# EAGLE design MotorController (EAGLE 9.6.2)

## Sheet 1 of 3
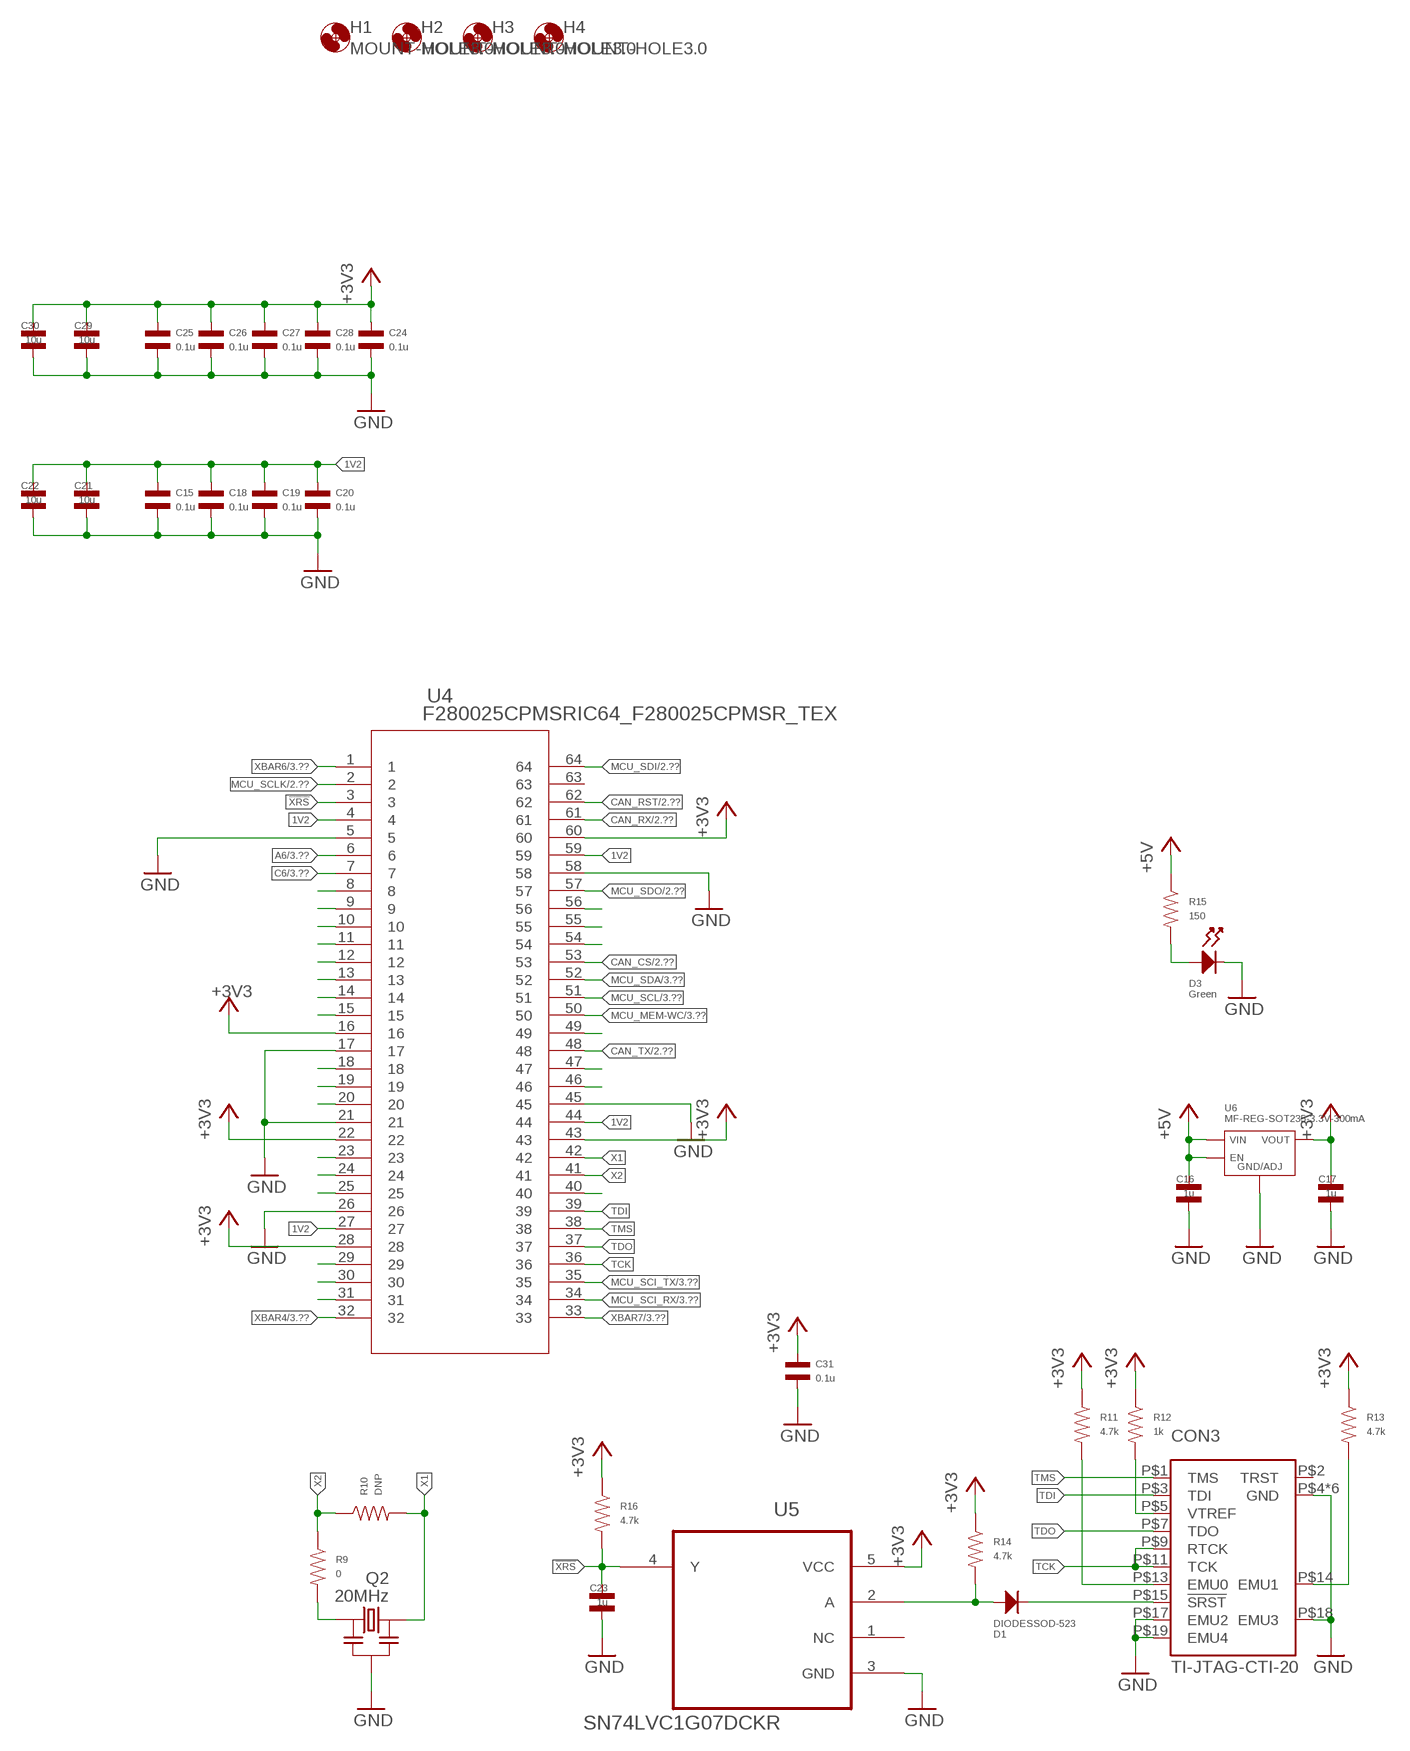
[diagram p0: schematic, sheet 1]

### Parts
C15  0.1u  CAPACITOR_NP_0402  [C0402]
C16  1u  CAPACITOR_NP_0805  [C0805]
C17  1u  CAPACITOR_NP_0805  [C0805]
C18  0.1u  CAPACITOR_NP_0402  [C0402]
C19  0.1u  CAPACITOR_NP_0402  [C0402]
C20  0.1u  CAPACITOR_NP_0402  [C0402]
C21  10u  CAPACITOR_NP_0805  [C0805]
C22  10u  CAPACITOR_NP_0805  [C0805]
C23  1u  CAPACITOR_NP_0402  [C0402]
C24  0.1u  CAPACITOR_NP_0402  [C0402]
C25  0.1u  CAPACITOR_NP_0402  [C0402]
C26  0.1u  CAPACITOR_NP_0402  [C0402]
C27  0.1u  CAPACITOR_NP_0402  [C0402]
C28  0.1u  CAPACITOR_NP_0402  [C0402]
C29  10u  CAPACITOR_NP_0805  [C0805]
C30  10u  CAPACITOR_NP_0805  [C0805]
C31  0.1u  CAPACITOR_NP_0402  [C0402]
CON3  TI-JTAG-CTI-20  [FTR-110-51-L-D-06]
D1  DIODESSOD-523  [SOD523]
D3  Green  LED_SINGLE-0603  [LED0603]
H1  MOUNT-HOLE3.0  [3,0]
H2  MOUNT-HOLE3.0  [3,0]
H3  MOUNT-HOLE3.0  [3,0]
H4  MOUNT-HOLE3.0  [3,0]
Q2  20MHz  RESONATORCSTNE  [CSTNE]
R9  0  RESISTOR_0402  [R0402]
R10  DNP  RESISTOR_0402  [R0402]
R11  4.7k  RESISTOR_0402  [R0402]
R12  1k  RESISTOR_0402  [R0402]
R13  4.7k  RESISTOR_0402  [R0402]
R14  4.7k  RESISTOR_0402  [R0402]
R15  150  RESISTOR_0805  [R0805]
R16  4.7k  RESISTOR_0402  [R0402]
U4  F280025CPMSRIC64_F280025CPMSR_TEX  [IC64_F280025CPMSR_TEX]
U5  SN74LVC1G07DCKR  [SOT65P210X110-5N]
U6  MF-REG-SOT235-3.3V-300mA  TLV70233PDBVR  [SOT-23-5]

### Nets
1V2: C15.P$1 C18.P$1 C19.P$1 C20.P$1 C21.P$1 C22.P$1 U4.4 U4.27 U4.44 U4.59
!XRS: C23.P$1 R16.P$2 U4.3 U5.4(Y)
+3V3: C17.P$1 C24.P$1 C25.P$1 C26.P$1 C27.P$1 C28.P$1 C29.P$1 C30.P$1 C31.P$1 R11.P$1 R12.P$1 R13.P$1 R14.P$1 R16.P$1 U4.16 U4.22 U4.28 U4.43 U4.60 U5.5(VCC) U6.P$5(VOUT) ; also sheet 2,3
+5V: C16.P$1 R15.P$1 U6.P$1(VIN) U6.P$3(EN) ; also sheet 2,3
A6: U4.6 ; also sheet 3
C6: U4.7 ; also sheet 3
CAN_CS: U4.53 ; also sheet 2
CAN_RST: U4.62 ; also sheet 2
CAN_RX: U4.61 ; also sheet 2
CAN_TX: U4.48 ; also sheet 2
GND: C15.P$2 C16.P$2 C17.P$2 C18.P$2 C19.P$2 C20.P$2 C21.P$2 C22.P$2 C23.P$2 C24.P$2 C25.P$2 C26.P$2 C27.P$2 C28.P$2 C29.P$2 C30.P$2 C31.P$2 CON3.P$4(GND) CON3.P$8(GND) CON3.P$10(GND) CON3.P$12(GND) CON3.P$16(GND) CON3.P$17(EMU2) CON3.P$18(EMU3) CON3.P$19(EMU4) CON3.P$20(GND) D3.CATHODE Q2.2(GND) U4.5 U4.17 U4.21 U4.26 U4.45 U4.58 U5.3(GND) U6.P$2(GND/ADJ) ; also sheet 2,3
MCU_MEM-WC: U4.50 ; also sheet 3
MCU_SCI_RX: U4.34 ; also sheet 3
MCU_SCI_TX: U4.35 ; also sheet 3
MCU_SCL: U4.51 ; also sheet 3
MCU_SCLK: U4.2 ; also sheet 2
MCU_SDA: U4.52 ; also sheet 3
MCU_SDI: U4.64 ; also sheet 2
MCU_SDO: U4.57 ; also sheet 2
N$1: D3.ANODE R15.P$2
N$2: U4.18
N$3: U4.19
N$5: CON3.P$5(VTREF) R12.P$2
N$6: Q2.3(XOUT) R9.P$2
N$7: U4.23
N$8: U4.24
N$9: U4.25
N$10: CON3.P$13(EMU0) R11.P$2
N$11: CON3.P$14(EMU1) R13.P$2
N$12: CON3.P$15(!SRST) D1.C(CATHODE)
N$13: U4.29
N$14: U4.30
N$15: U4.31
N$20: U4.49
N$22: U4.20
N$24: U4.40
N$25: D1.A(ANODE) R14.P$2 U5.2(A)
N$27: U4.9
N$29: U4.10
N$30: U4.46
N$31: U4.47
N$32: U4.11
N$33: U4.12
N$34: U4.13
N$35: U4.14
N$36: U4.15
N$40: U4.8
N$54: U4.54
N$55: U4.55
N$56: U4.56
TCK: CON3.P$9(RTCK) CON3.P$11(TCK) U4.36
TDI: CON3.P$3(TDI) U4.39
TDO: CON3.P$7(TDO) U4.37
TMS: CON3.P$1(TMS) U4.38
X1: Q2.1(XIN) R10.P$2 U4.42
X2: R9.P$1 R10.P$1 U4.41
XBAR4: U4.32 ; also sheet 3
XBAR6: U4.1 ; also sheet 3
XBAR7: U4.33 ; also sheet 3
Unconnected: CON3.P$2(TRST) U4.63 U5.1(NC)

## Sheet 2 of 3
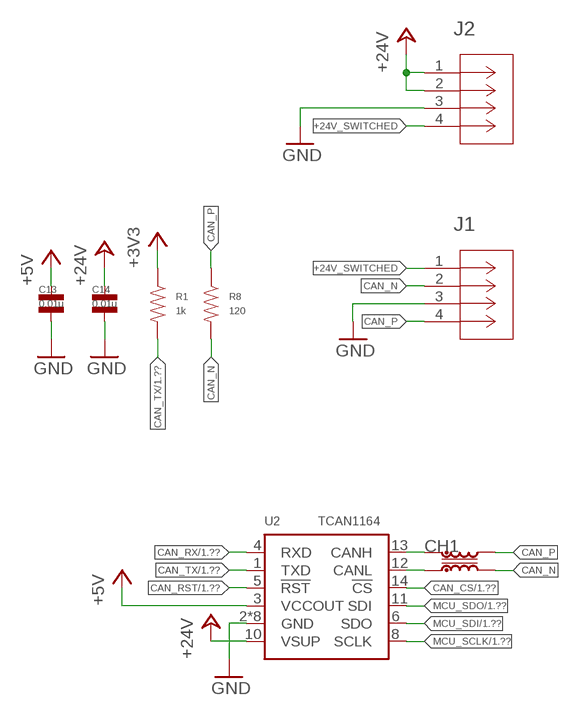
[diagram p1: schematic, sheet 2]

### Parts
C13  0.01u  CAPACITOR_NP_0402  [C0402]
C14  0.01u  CAPACITOR_NP_0402  [C0402]
CH1  CHOKE-COMMON_MODECM1210-LAIRD  [CM1210-LAIRD]
J1  768250004CON_768250004_MOL  [CON_768250004_MOL]
J2  768250004CON_768250004_MOL  [CON_768250004_MOL]
R1  1k  RESISTOR_0402  [R0402]
R8  120  RESISTOR_0402  [R0402]
U2  TCAN1164  [CONV_TPS63021DSJ]

### Nets
+3V3: R1.P$1 ; also sheet 1,3
+5V: C13.P$1 U2.3(VCCOUT) ; also sheet 1,3
+24V: C14.P$1 J2.1 J2.2 U2.10(VSUP)
+24V_SWITCHED: J1.1 J2.4
CAN_CS: U2.14(!CS) ; also sheet 1
CAN_N: CH1.P$3 J1.2 R8.P$2
CAN_P: CH1.P$2 J1.4 R8.P$1
CAN_RST: U2.5(!RST) ; also sheet 1
CAN_RX: U2.4(RXD) ; also sheet 1
CAN_TX: R1.P$2 U2.1(TXD) ; also sheet 1
GND: C13.P$2 C14.P$2 J1.3 J2.3 U2.2(GND) U2.15(GND) U2.15_1(GND) U2.15_2(GND) U2.15_3(GND) U2.15_4(GND) U2.15_5(GND) U2.15_6(GND) ; also sheet 1,3
MCU_SCLK: U2.8(SCLK) ; also sheet 1
MCU_SDI: U2.6(SDO) ; also sheet 1
MCU_SDO: U2.11(SDI) ; also sheet 1
N$4: CH1.P$4 U2.12(CANL)
N$17: CH1.P$1 U2.13(CANH)

## Sheet 3 of 3
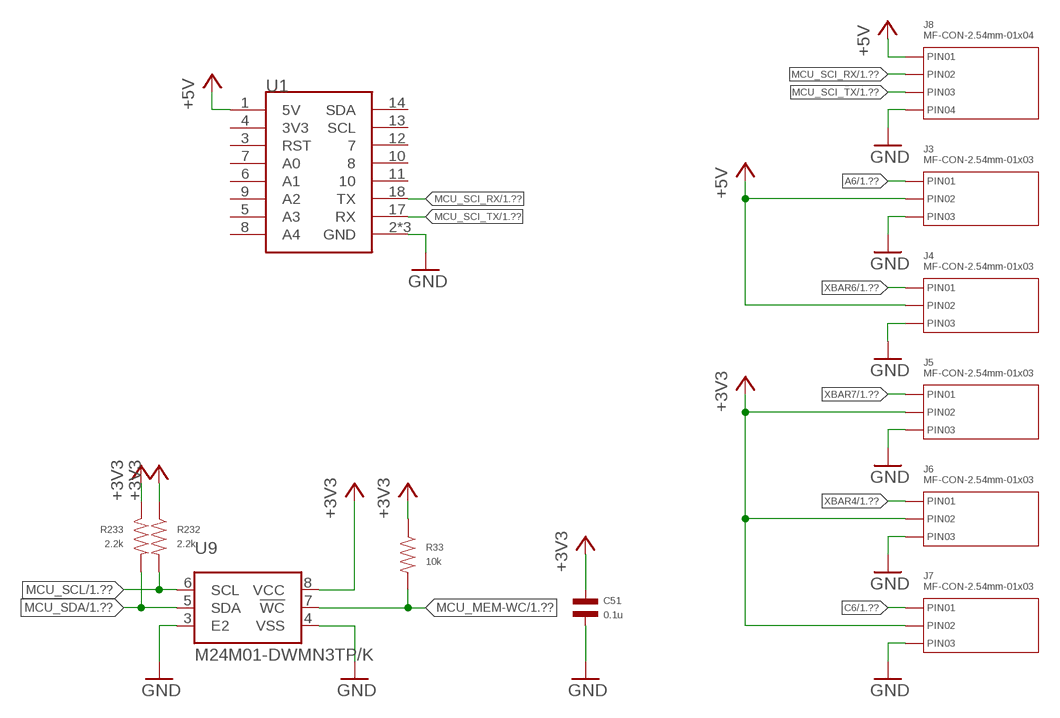
[diagram p2: schematic, sheet 3]

### Parts
C51  0.1u  CAPACITOR_NP_0402  [C0402]
J3  MF-CON-2.54mm-01x03  CON_01X03_PTH_2.54MM  [PTH_2.54MM_01X03]
J4  MF-CON-2.54mm-01x03  CON_01X03_PTH_2.54MM  [PTH_2.54MM_01X03]
J5  MF-CON-2.54mm-01x03  CON_01X03_PTH_2.54MM  [PTH_2.54MM_01X03]
J6  MF-CON-2.54mm-01x03  CON_01X03_PTH_2.54MM  [PTH_2.54MM_01X03]
J7  MF-CON-2.54mm-01x03  CON_01X03_PTH_2.54MM  [PTH_2.54MM_01X03]
J8  MF-CON-2.54mm-01x04  CON_01X04_PTH_2.54MM  [PTH_2.54MM_01X04]
R33  10k  RESISTOR_0402  [R0402]
R232  2.2k  RESISTOR_0402  [R0402]
R233  2.2k  RESISTOR_0402  [R0402]
U1  ESP32-C3  [ESP32-C3]
U9  M24M01-DWMN3TP/K  M24M02-DWMN3TP/K  [SOIC-8]

### Nets
+3V3: C51.P$1 J5.P$2(PIN2) J6.P$2(PIN2) J7.P$2(PIN2) R33.P$1 R232.P$1 R233.P$1 U9.8(VCC) ; also sheet 1,2
+5V: J3.P$2(PIN2) J4.P$2(PIN2) J8.P$1(PIN1) U1.1(5V) ; also sheet 1,2
A6: J3.P$1(PIN1) ; also sheet 1
C6: J7.P$1(PIN1) ; also sheet 1
GND: C51.P$2 J3.P$3(PIN3) J4.P$3(PIN3) J5.P$3(PIN3) J6.P$3(PIN3) J7.P$3(PIN3) J8.P$4(PIN4) U1.2(GND) U1.15(GND) U1.16(GND) U9.3(E2) U9.4(VSS) ; also sheet 1,2
MCU_MEM-WC: R33.P$2 U9.7(!WC) ; also sheet 1
MCU_SCI_RX: J8.P$2(PIN2) U1.18(TX) ; also sheet 1
MCU_SCI_TX: J8.P$3(PIN3) U1.17(RX) ; also sheet 1
MCU_SCL: R232.P$2 U9.6(SCL) ; also sheet 1
MCU_SDA: R233.P$2 U9.5(SDA) ; also sheet 1
XBAR4: J6.P$1(PIN1) ; also sheet 1
XBAR6: J4.P$1(PIN1) ; also sheet 1
XBAR7: J5.P$1(PIN1) ; also sheet 1
Unconnected: U1.3(RST) U1.4(3V3) U1.5(A3) U1.6(A1) U1.7(A0) U1.8(A4) U1.9(A2) U1.10 U1.11 U1.12 U1.13(SCL) U1.14(SDA)

## Library data of the parts
C13 C14 = MF_Passives:CAPACITOR_NP: Library: MF_Passives Description: Device for Non-Polarized Capacitors. Manufacture part number (MPN) can be added via Attributes. Check https://factory.macrofab.com/parts for the house parts list.; MPN: CL05B103KB5NNNC; POPULATE: 1
C15 C18-C20 C24-C28 C31 C51 = MF_Passives:CAPACITOR_NP: Library: MF_Passives Description: Device for Non-Polarized Capacitors. Manufacture part number (MPN) can be added via Attributes. Check https://factory.macrofab.com/parts for the house parts list.; MPN: GCM155R71H104KE02D; POPULATE: 1
C16 C17 = MF_Passives:CAPACITOR_NP: Library: MF_Passives Description: Device for Non-Polarized Capacitors. Manufacture part number (MPN) can be added via Attributes. Check https://factory.macrofab.com/parts for the house parts list.; MPN: CL21B105KAFNNNE; POPULATE: 1
C21 C22 C29 C30 = MF_Passives:CAPACITOR_NP: Library: MF_Passives Description: Device for Non-Polarized Capacitors. Manufacture part number (MPN) can be added via Attributes. Check https://factory.macrofab.com/parts for the house parts list.; MPN: CL21A106KAYNNNE; POPULATE: 1
C23 = MF_Passives:CAPACITOR_NP: Library: MF_Passives Description: Device for Non-Polarized Capacitors. Manufacture part number (MPN) can be added via Attributes. Check https://factory.macrofab.com/parts for the house parts list.; MPN: CL05A105KA5NQNC; POPULATE: 1
CH1 = vehicle-control:CHOKE-COMMON_MODE; MPN: CM1210B104R-1A
CON3 = vehicle-control:TI-JTAG-CTI-20; MPN: FTR-110-51-L-D-06
D1 = MF_Discrete_Semiconductor:DIODES: Library: MF_Discrete_Semiconductor Description: Device for Single Packaged Diodes.; MPN: RB510SM-40FHT2R
D3 = MF_LEDs:LED_SINGLE: Library: MF_LEDs Description: Device for Single LED Packages. Manufacture part number (MFG#) can be added via Attributes.; HOUSEPART: NO; MPN: SML-E12P8WT86; POPULATE: 1
H1-H4 = holes:MOUNT-HOLE: MOUNTING HOLE with drill center marker
J1 J2 = Molex0768250004:768250004; COPYRIGHT: Copyright (C) 2024 Ultra Librarian. All rights reserved.; MANUFACTURER_PART_NUMBER: 768250004; MFR_NAME: Molex Connector Corporation; MPN: 0768250004
J3-J7 = MF_Connectors:CON_01X03: Library: MF_Connectors Description: Header Connector with 03 Positions and 01 Rows. Use the LABEL Attribute to label the pin on the schematic and PCB. You can remove the attributes on the PCB by using the SMASH function on the part and then deleting the text.; HOUSEPART: YES; MPN: MF-CON-2.54mm-01x03; POPULATE: 1; URL: https://factory.macrofab.com/part/MF-CON-2.54mm-01x03
J8 = MF_Connectors:CON_01X04: Library: MF_Connectors Description: Header Connector with 04 Positions and 01 Rows. Use the LABEL Attribute to label the pin on the schematic and PCB. You can remove the attributes on the PCB by using the SMASH function on the part and then deleting the text.; HOUSEPART: YES; MPN: MF-CON-2.54mm-01x04; POPULATE: 1; URL: https://factory.macrofab.com/part/MF-CON-2.54mm-01x04
Q2 = vehicle-control:RESONATOR; MPN: CSTNE20M0V53C000R0
R1 R12 = MF_Passives:RESISTOR: Library: MF_Passives Description: Device for Resistors. Manufacture part number (MPN), Voltage, Tolerance, and Wattage Rating can be added via Attributes. Check https://factory.macrofab.com/parts for the house parts list.; MPN: ERJ-2RKF1001X; POPULATE: 1
R8 = MF_Passives:RESISTOR: Library: MF_Passives Description: Device for Resistors. Manufacture part number (MPN), Voltage, Tolerance, and Wattage Rating can be added via Attributes. Check https://factory.macrofab.com/parts for the house parts list.; MPN: ERJ-2GEJ121X; POPULATE: 1
R9 = MF_Passives:RESISTOR: Library: MF_Passives Description: Device for Resistors. Manufacture part number (MPN), Voltage, Tolerance, and Wattage Rating can be added via Attributes. Check https://factory.macrofab.com/parts for the house parts list.; MPN: ERJ-2GE0R00X; POPULATE: 1
R10 = MF_Passives:RESISTOR: Library: MF_Passives Description: Device for Resistors. Manufacture part number (MPN), Voltage, Tolerance, and Wattage Rating can be added via Attributes. Check https://factory.macrofab.com/parts for the house parts list.; POPULATE: 1
R11 R13 R14 R16 = MF_Passives:RESISTOR: Library: MF_Passives Description: Device for Resistors. Manufacture part number (MPN), Voltage, Tolerance, and Wattage Rating can be added via Attributes. Check https://factory.macrofab.com/parts for the house parts list.; MPN: ERJ-2RKF4701X; POPULATE: 1
R15 = MF_Passives:RESISTOR: Library: MF_Passives Description: Device for Resistors. Manufacture part number (MPN), Voltage, Tolerance, and Wattage Rating can be added via Attributes. Check https://factory.macrofab.com/parts for the house parts list.; MPN: ERJ-6GEYJ151V; POPULATE: 1
R33 = MF_Passives:RESISTOR: Library: MF_Passives Description: Device for Resistors. Manufacture part number (MPN), Voltage, Tolerance, and Wattage Rating can be added via Attributes. Check https://factory.macrofab.com/parts for the house parts list.; MPN: ERJ-2RKF1002X; POPULATE: 1
R232 R233 = MF_Passives:RESISTOR: Library: MF_Passives Description: Device for Resistors. Manufacture part number (MPN), Voltage, Tolerance, and Wattage Rating can be added via Attributes. Check https://factory.macrofab.com/parts for the house parts list.; MPN: ERJ-2RKF2201X; POPULATE: 1
U1 = ESP32:ESP32-C3
U2 = TCAN1043GDMTRQ1:TCAN1164; MPN: TCAN1164DMTRQ1
U4 = F280025CPMSR:F280025CPMSR; COPYRIGHT: Copyright (C) 2024 Ultra Librarian. All rights reserved.; MANUFACTURER_PART_NUMBER: F280025CPMSR; MFR_NAME: Texas Instruments; MPN: F280025CPMSR
U5 = Texas Instruments_By_element14_Batch_1:SN74LVC1G07DCKR: SINGLE BUFFER/DRIVER WITH OPEN-DRAIN OUTPUT; MPN: SN74LVC1G07DCKR; OC_FARNELL: 1287544; OC_NEWARK: 76C4075; PACKAGE: SC70-5; SUPPLIER: Texas Instruments
U6 = MF_IC_Power:TLV702: Manufacturer Part #: TLV702 Manufacturer: Texas Instruments Description: LDO Voltage Regulators; HOUSEPART: YES; MPN: TLV70233PDBVR; POPULATE: 1; URL: https://factory.macrofab.com/part/MF-REG-SOT235-3.3V-300mA
U9 = vehicle-control:M24M02-DWMN3TP/K; MPN: M24M01-DWMN3TP/K

## Board
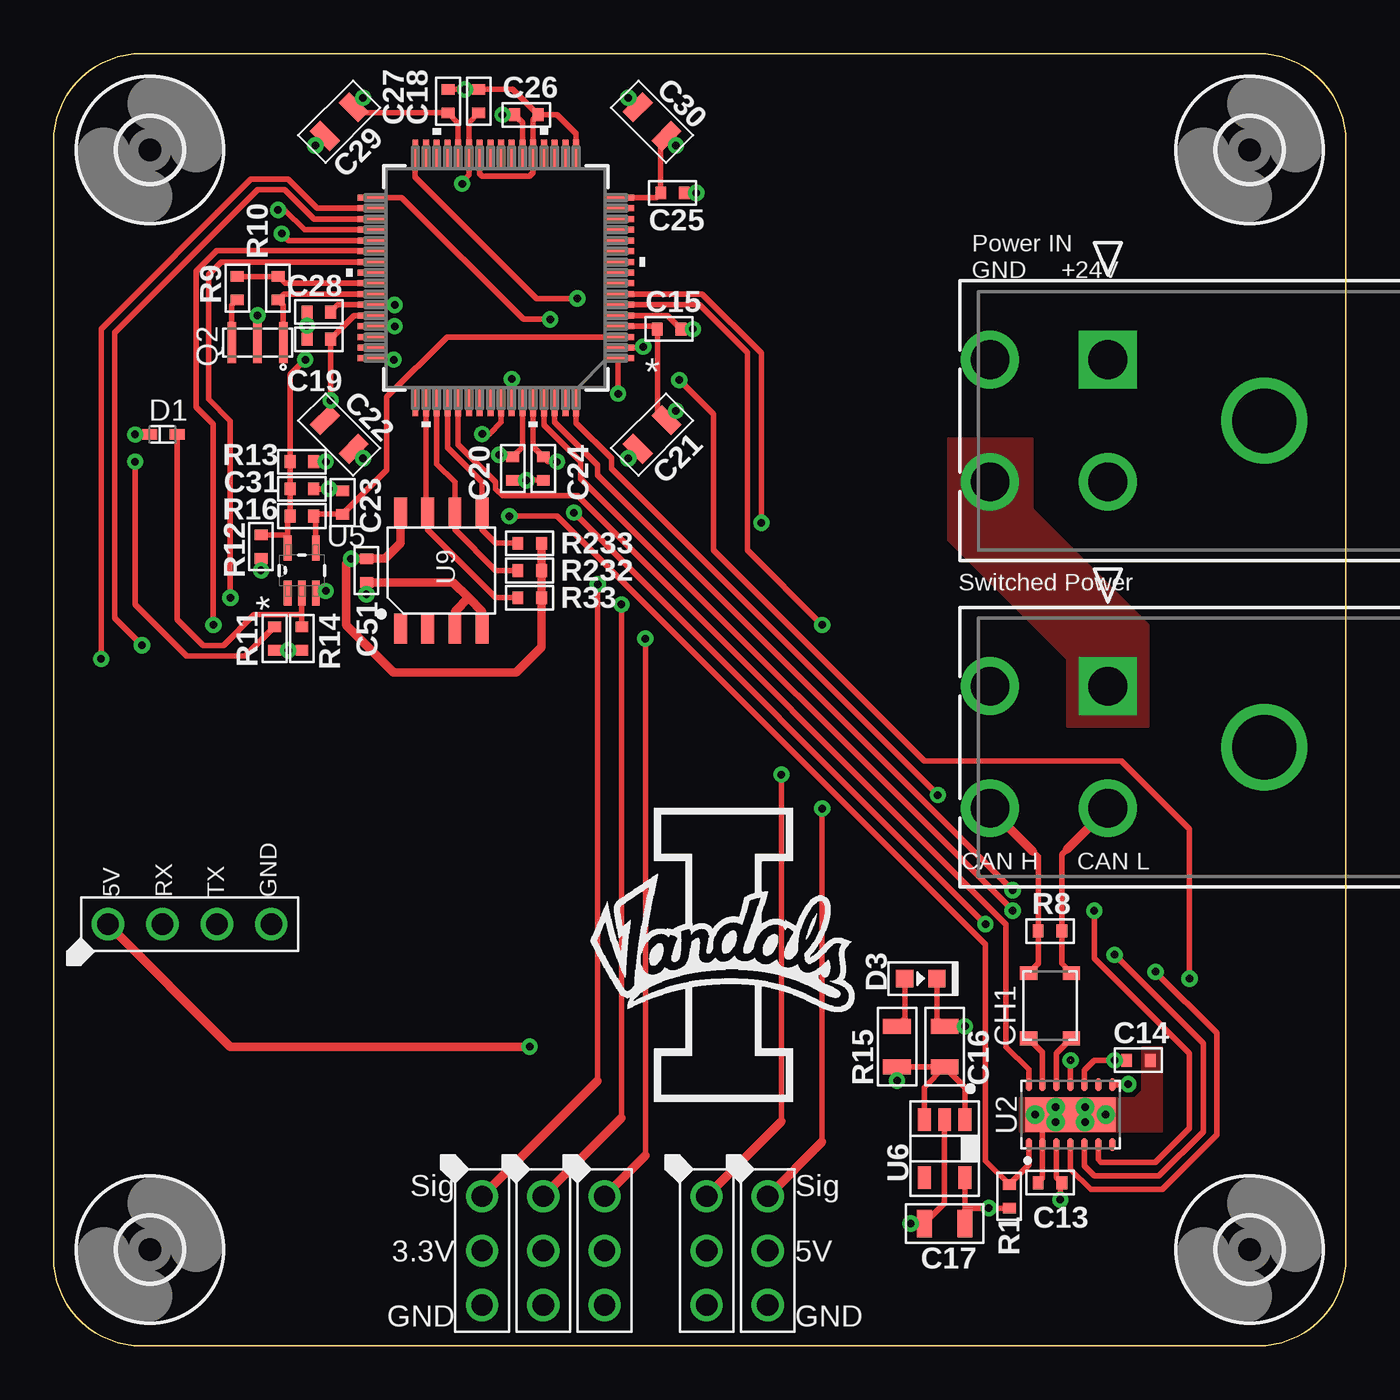
[diagram p3: board, top side]
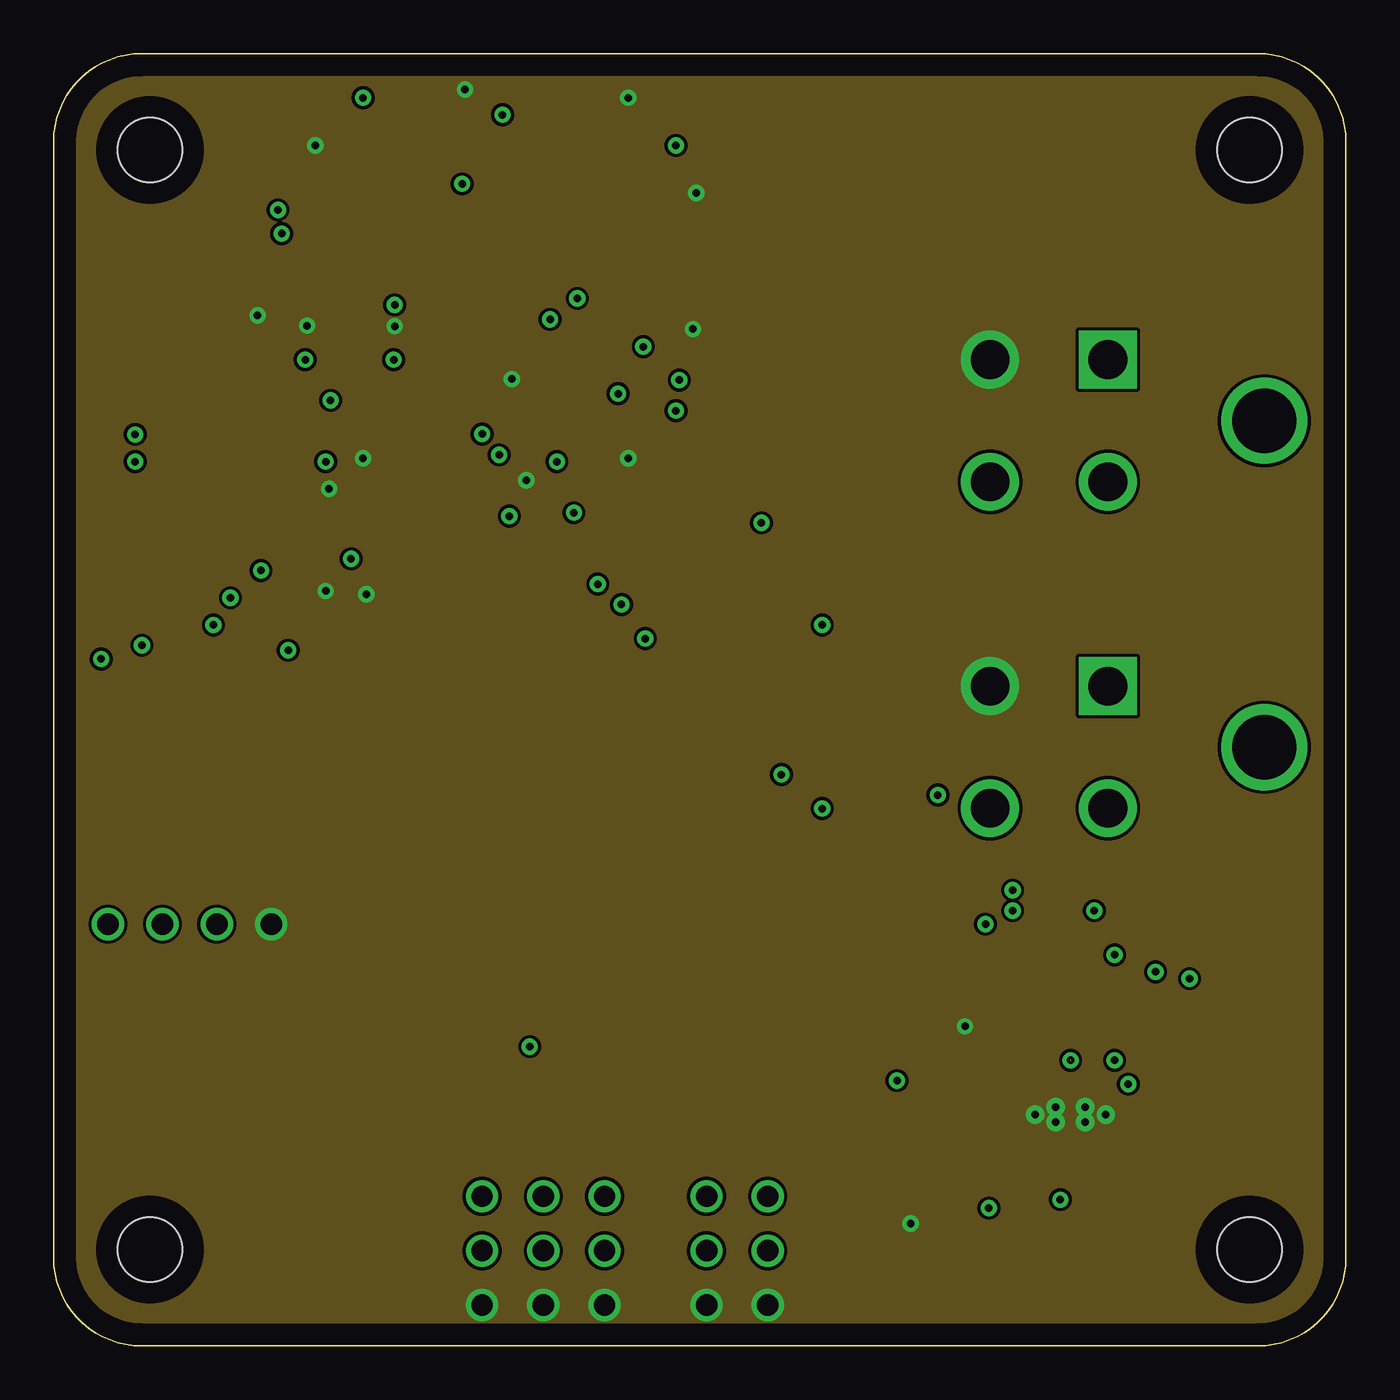
[diagram p4: board, inner layer GND]
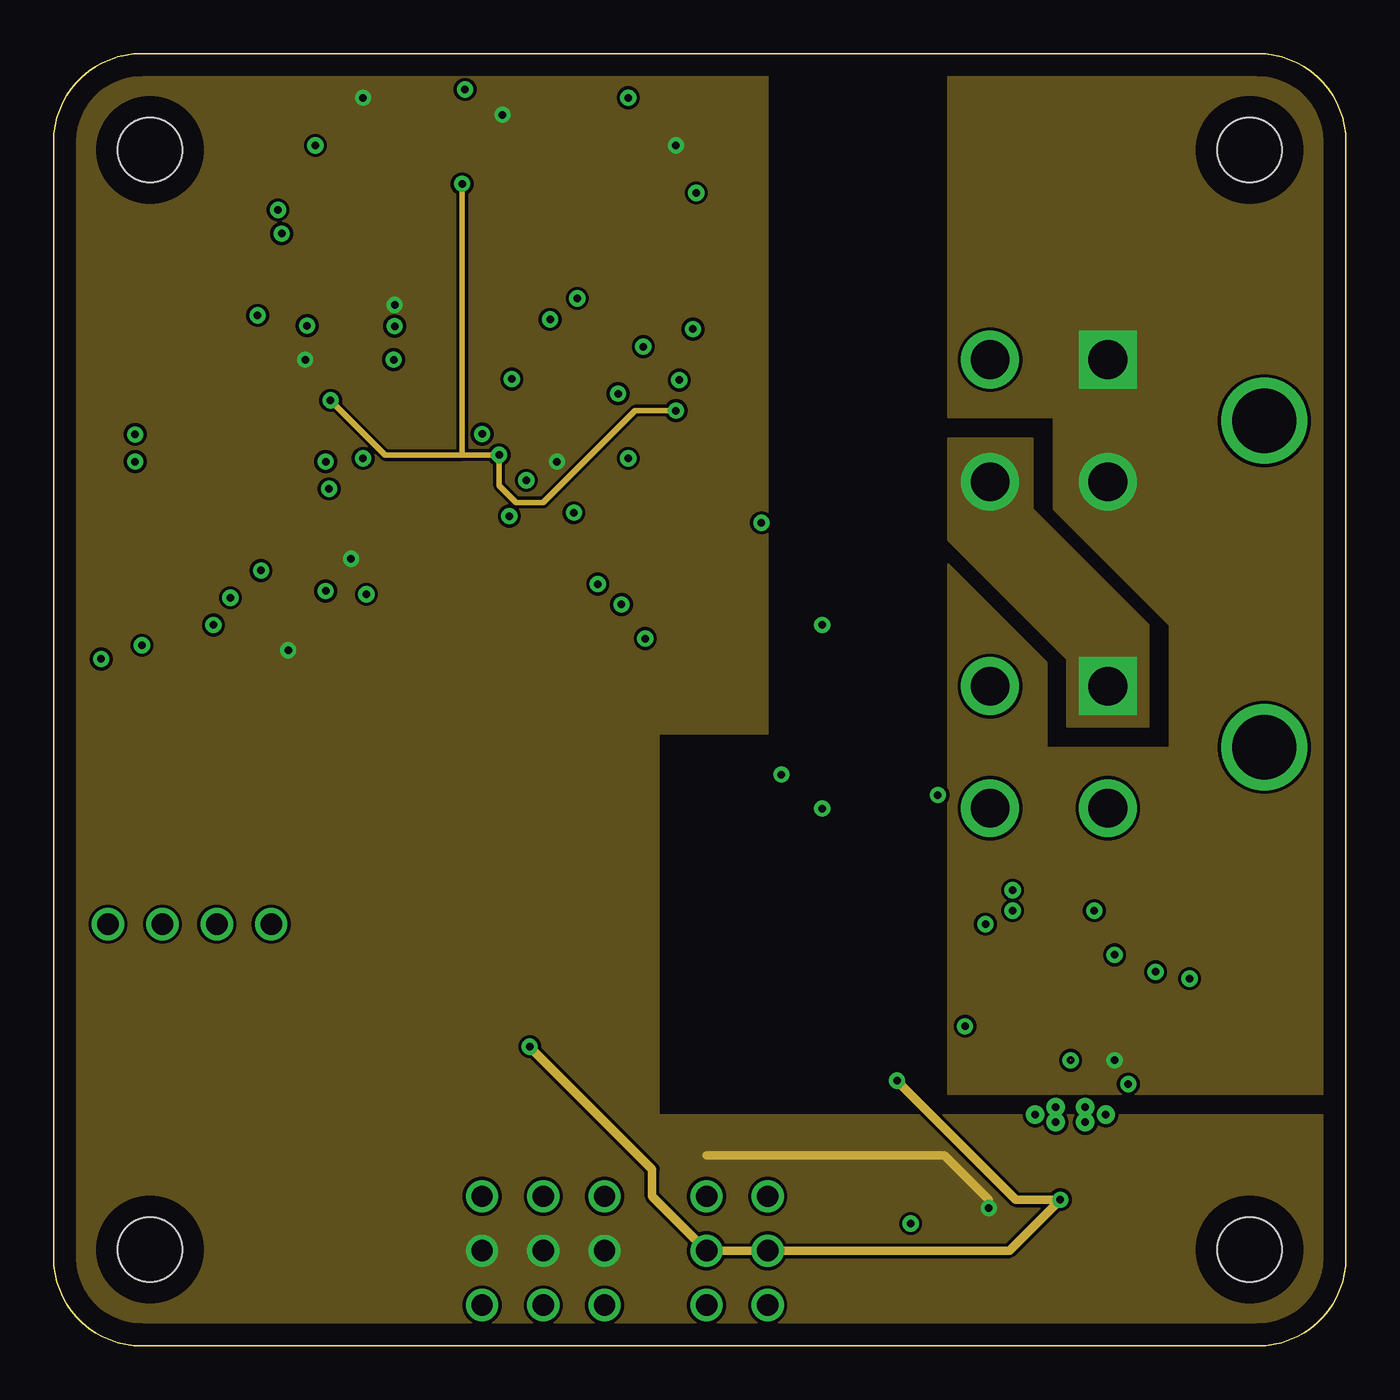
[diagram p5: board, inner layer PWR]
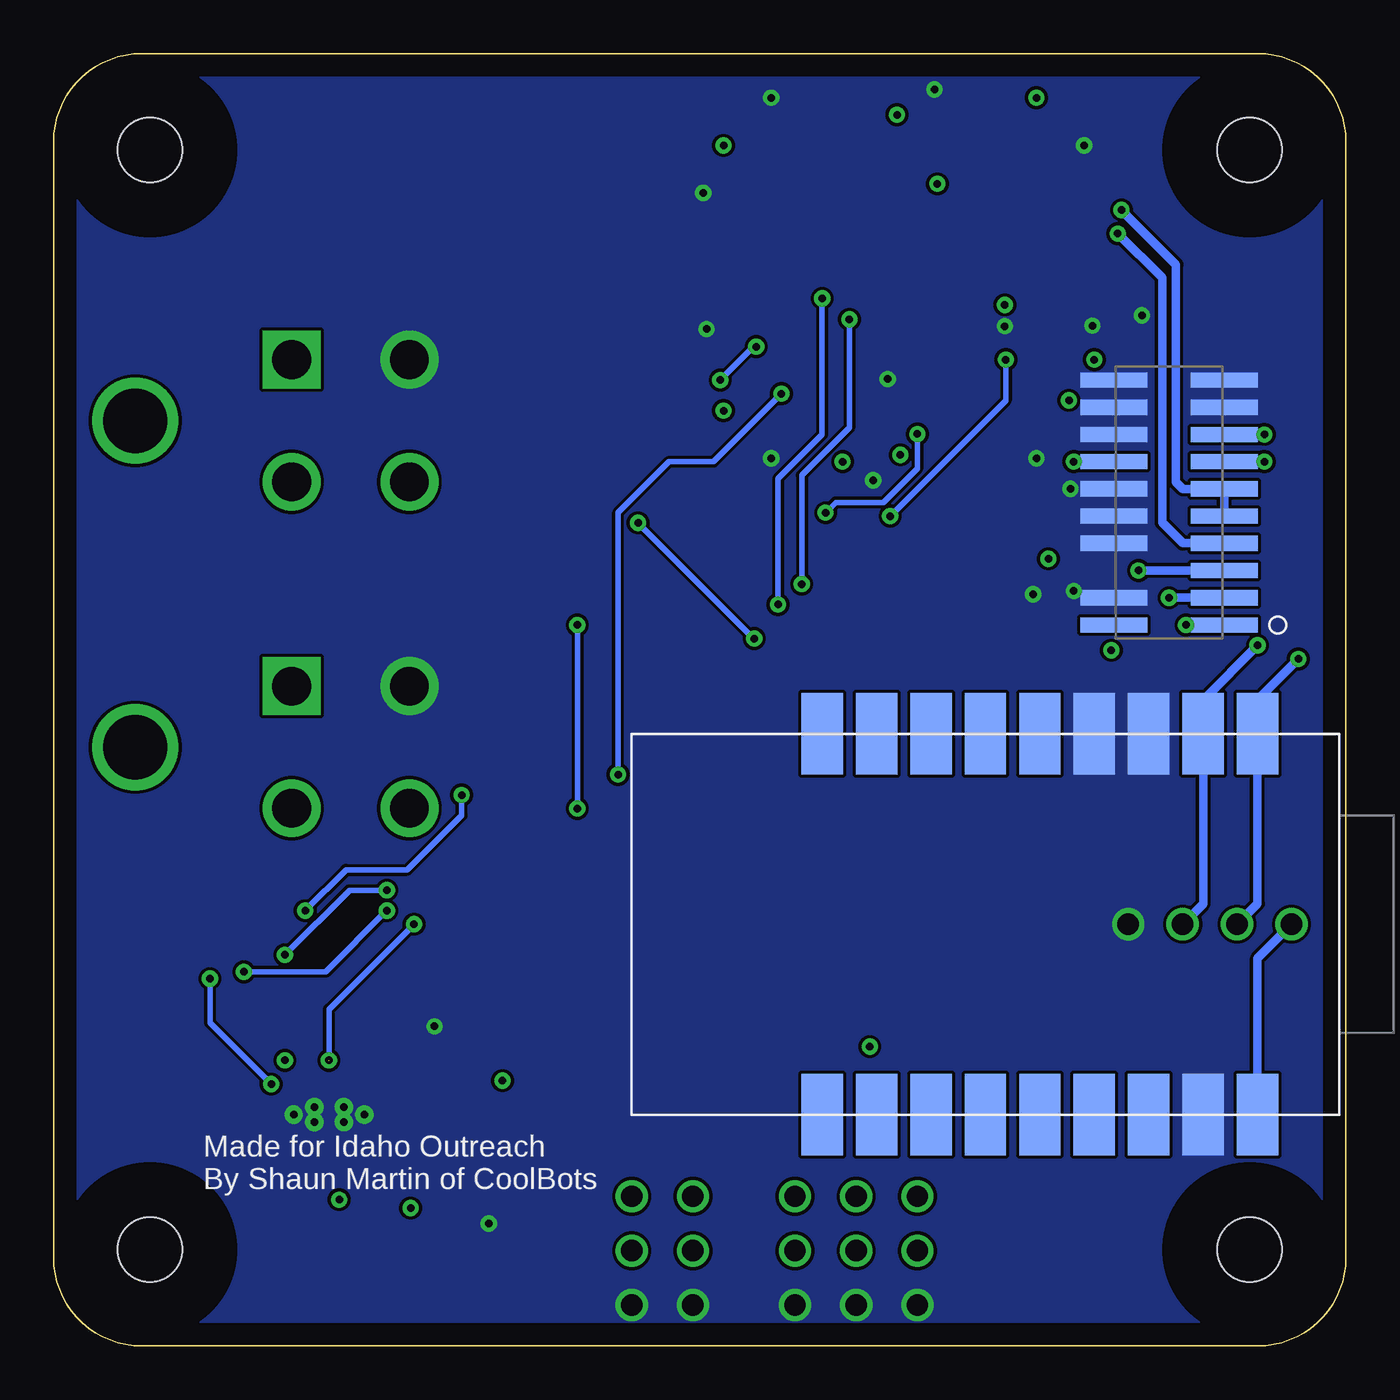
[diagram p6: board, bottom side, seen from below]

Size 60.33 x 60.33 mm. Coordinates in mm from the lower left corner, seen from the top.
Outline: 4.13,0 arc-90 0,4.13 0,56.2 arc-90 4.13,60.33 56.2,60.33 arc-90 60.33,56.2 60.33,4.13 arc-90 56.2,0 4.13,0
Copper layers (1+2*15+16): Top 0.035mm / dielectric 0.35mm / GND 0.035mm / dielectric 0.35mm / PWR 0.035mm / dielectric 0.35mm / Bottom 0.035mm
Design rules "default *": minimum track width 6mil, minimum drill 0.35mm, track to track 6mil, track to pad 6mil, pad to pad 6mil, via to via 6mil, smd to smd 6mil, copper to edge 40mil, drill to drill 6mil, minimum pad ring 10mil, minimum via ring 8mil, stop-mask expansion 4mil, vias tented up to drill 0mil, thermal gap 10mil

### Footprints (pad centres in the part's own frame; a part is rotated, then mirrored left to right if it is on the bottom)
C0402 = smd 0.5 x 0.6: P$1 -0.55,0; P$2 0.55,0
C0805 = smd 0.7 x 1.3: P$1 -0.95,0; P$2 0.95,0
CM1210-LAIRD = smd 0.65 x 0.8: P$1 -1.525,1; P$2 1.525,1; P$3 1.525,-1; P$4 -1.525,-1
FTR-110-51-L-D-06 = smd 0.711 x 3.124: P$1 -5.715,-2.578; P$2 -5.715,2.578; P$3 -4.445,-2.578; P$4 -4.445,2.578; P$5 -3.175,-2.578; P$7 -1.905,-2.578; P$8 -1.905,2.578; P$9 -0.635,-2.578; P$10 -0.635,2.578; P$11 0.635,-2.578; P$12 0.635,2.578; P$13 1.905,-2.578; P$14 1.905,2.578; P$15 3.175,-2.578; P$16 3.175,2.578; P$17 4.445,-2.578; P$18 4.445,2.578; P$19 5.715,-2.578; P$20 5.715,2.578
SOD523 = smd 0.7 x 0.5: A 0.7,0; C -0.6,0
LED0603 = smd 0.8 x 0.8: ANODE 0.75,0; CATHODE -0.75,0
3,0 = hole 3: 0,0
CON_768250004_MOL = drill 1.8 pad 2.3 square: 1 0,0 | drill 1.8 pad 2.3: 2 -5.7,0; 3 0,5.5; 4 -5.7,5.5 | drill 3 pad 3: 5 -2.85,-7.3
PTH_2.54MM_01X03 = drill 1: P$1 -2.54,0; P$2 0,0; P$3 2.54,0
PTH_2.54MM_01X04 = drill 1: P$1 -3.81,0; P$2 -1.27,0; P$3 1.27,0; P$4 3.81,0
CSTNE = smd 0.4 x 1.9: 1 -1.2,0; 2 0,0; 3 1.2,0
R0402 = smd 0.5 x 0.6: P$1 -0.55,0; P$2 0.55,0
R0805 = smd 0.7 x 1.3: P$1 -0.95,0; P$2 0.95,0
ESP32-C3 = smd 3.81 x 1.93: 1 8.89,12.7; 2 8.89,10.16; 3 8.89,7.62; 4 8.89,5.08; 5 8.89,2.54; 6 8.89,0; 7 8.89,-2.54; 8 8.89,-5.08; 9 8.89,-7.62; 10 -8.89,-7.62; 11 -8.89,-5.08; 12 -8.89,-2.54; 13 -8.89,0; 14 -8.89,2.54; 15 -8.89,5.08; 16 -8.89,7.62; 17 -8.89,10.16; 18 -8.89,12.7
CONV_TPS63021DSJ = smd 0.6 x 0.3: 1 -1.4,1.95; 2 -1.4,1.3; 3 -1.4,0.65; 4 -1.4,0; 5 -1.4,-0.65; 6 -1.4,-1.3; 7 -1.4,-1.95; 8 1.4,-1.95; 9 1.4,-1.3; 10 1.4,-0.65; 11 1.4,0; 12 1.4,0.65; 13 1.4,1.3; 14 1.4,1.95 | smd 1.6 x 4.2: 15 0,0 | drill 0.35 pad 0.406: 15_1 0,1.65; 15_2 -0.35,0.69; 15_3 0.35,0.69; 15_4 -0.35,-0.69; 15_5 0.35,-0.69; 15_6 0,-1.65
IC64_F280025CPMSR_TEX = smd 1.35 x 0.279: 1 -5.78,3.75; 2 -5.78,3.25; 3 -5.78,2.75; 4 -5.78,2.25; 5 -5.78,1.75; 6 -5.78,1.25; 7 -5.78,0.75; 8 -5.78,0.25; 9 -5.78,-0.25; 10 -5.78,-0.75; 11 -5.78,-1.25; 12 -5.78,-1.75; 13 -5.78,-2.25; 14 -5.78,-2.75; 15 -5.78,-3.25; 16 -5.78,-3.75; 33 5.78,-3.75; 34 5.78,-3.25; 35 5.78,-2.75; 36 5.78,-2.25; 37 5.78,-1.75; 38 5.78,-1.25; 39 5.78,-0.75; 40 5.78,-0.25; 41 5.78,0.25; 42 5.78,0.75; 43 5.78,1.25; 44 5.78,1.75; 45 5.78,2.25; 46 5.78,2.75; 47 5.78,3.25; 48 5.78,3.75 | smd 0.279 x 1.35: 17 -3.75,-5.78; 18 -3.25,-5.78; 19 -2.75,-5.78; 20 -2.25,-5.78; 21 -1.75,-5.78; 22 -1.25,-5.78; 23 -0.75,-5.78; 24 -0.25,-5.78; 25 0.25,-5.78; 26 0.75,-5.78; 27 1.25,-5.78; 28 1.75,-5.78; 29 2.25,-5.78; 30 2.75,-5.78; 31 3.25,-5.78; 32 3.75,-5.78; 49 3.75,5.78; 50 3.25,5.78; 51 2.75,5.78; 52 2.25,5.78; 53 1.75,5.78; 54 1.25,5.78; 55 0.75,5.78; 56 0.25,5.78; 57 -0.25,5.78; 58 -0.75,5.78; 59 -1.25,5.78; 60 -1.75,5.78; 61 -2.25,5.78; 62 -2.75,5.78; 63 -3.25,5.78; 64 -3.75,5.78
SOT65P210X110-5N = smd 1.168 x 0.356: 1 -1.041,0.66; 2 -1.041,0; 3 -1.041,-0.66; 4 1.041,-0.66; 5 1.041,0.66
SOT-23-5 = smd 1.05 x 0.6: P$1 -1.35,0.95; P$2 -1.35,0; P$3 -1.35,-0.95; P$4 1.35,-0.95; P$5 1.35,0.95
SOIC-8 = smd 0.6 x 1.4: 1 -1.905,-2.7; 2 -0.635,-2.7; 3 0.635,-2.7; 4 1.905,-2.7; 5 1.905,2.7; 6 0.635,2.7; 7 -0.635,2.7; 8 -1.905,2.7

### Placement (x,y rotation side)
C13  46.51,7.62 180 top
C14  50.64,13.34 0 top
C15  28.73,47.47 0 top
C16  41.59,13.97 90 top
C17  41.59,5.71 180 top
C18  19.84,58.1 90 top
C19  12.38,46.99 180 top
C20  21.43,40.96 270 top
C21  27.94,42.55 225 top
C22  13.34,42.55 315 top
C23  13.49,39.37 90 top
C24  22.86,40.96 270 top
C25  28.89,53.82 0 top
C26  22.07,57.47 0 top
C27  18.41,58.1 90 top
C28  12.38,48.26 180 top
C29  13.34,57.15 225 top
C30  27.94,57.15 135 top
C31  11.59,40.01 0 top
C51  14.61,36.2 270 top
CH1  46.51,15.88 90 top
CON3  8.26,39.37 90 bottom
D1  5.08,42.55 0 top
D3  40.48,17.14 180 top
H1  55.82,55.82 0 top
H2  4.5,4.5 0 top
H3  4.5,55.82 0 top
H4  55.82,4.5 0 top
J1  49.21,30.8 90 top
J2  49.21,46.04 90 top
J3  33.34,4.45 270 top
J4  30.48,4.45 270 top
J5  20,4.45 270 top
J6  22.86,4.45 270 top
J7  25.72,4.45 270 top
J8  6.35,19.68 0 top
Q2  9.53,46.83 180 top
R1  44.61,6.99 90 top
R8  46.51,19.37 0 top
R9  8.57,49.37 270 top
R10  10.48,49.37 270 top
R11  10.32,33.02 90 top
R12  9.68,37.31 270 top
R13  11.59,41.27 0 top
R14  11.59,33.02 90 top
R15  39.37,13.97 90 top
R16  11.59,38.73 0 top
R33  22.23,34.92 180 top
R232  22.23,36.2 180 top
R233  22.23,37.47 180 top
U1  16.83,19.68 270 bottom
U2  47.47,10.79 90 top
U4  20.64,49.85 180 top
U5  11.59,36.2 90 top
U6  41.59,9.21 270 top
U9  18.1,36.2 0 top

### Tracks (layer width: path | path; a pad name or v marks a point on that pad's centre or on a via)
1V2  (via drill 0.35)
  Top 0.254: U4.59 21.89,41.96 C20.P$1 21.35,41.59 v20.8,41.59 | U4.4 28.26,47.6 C15.P$1 28.18,43.65 C21.P$1 v29.05,43.66 | C18.P$1 19.39,57.1 U4.27 19.39,54.67 19.07,54.36 v19.07,54.24 | U4.44 14.04,48.1 C19.P$1 v12.93,44.13 12.93,43.49 C22.P$1 | v29.05,43.66
  PWR 0.254: v29.05,43.66 27.15,43.66 22.86,39.37 21.59,39.37 20.8,40.16 v20.8,41.59 19.07,41.59 | v12.93,44.13 15.47,41.59 19.07,41.59 | v19.07,54.24 19.07,41.59
!XRS
  Top 0.254: 12.22,38.82 C23.P$1 15.56,40.88 15.56,44.29 18.36,47.1 U4.3 | 12.22,38.82 R16.P$2 | U5.4 12.22,37.26 12.22,38.82
+3V3  (via drill 0.35)
  Top 0.254: U4.60 22.39,41.98 C24.P$1 23.09,41.27 v23.5,41.27 | U4.16 28.12,53.6 C25.P$1 28.34,56.21 C30.P$1 v29.05,56.04 | U4.28 18.89,57.08 C27.P$1 14.28,57.55 C29.P$1 v14.45,58.26 | C28.P$1 13.27,48.6 U4.43 v15.92,48.6 | U4.22 21.89,57.1 C26.P$1 v20.95,57.47 | R14.P$1 v10.95,32.47 R11.P$1 | U5.5 10.93,37.78 | 10.93,37.78 10.93,38.62 R16.P$1 C31.P$1 R13.P$1 11.04,45.33 v11.75,46.04 | R12.P$1 10.86,37.86 10.93,37.78 | U6.P$5 42.54,6.35 | 42.54,6.35 C17.P$1 42.7,5.87 | R1.P$1 v43.66,6.43 42.63,6.43 42.54,6.35
  Top 0.406: R233.P$1 R232.P$1 R33.P$1 22.77,32.62 21.59,31.43 15.88,31.43 13.65,33.66 13.65,36.51 v13.88,36.74 C51.P$1 15.47,36.74 16.19,37.47 U9.8
  PWR 0.406: 30.48,8.89 41.59,8.89 43.66,6.83 v43.66,6.43
  pour PWR (no thermals): 60.33,10.79 28.26,10.79 28.26,28.57 33.34,28.57 33.34,60.33 0,60.33 0,0 60.33,0
+5V  (via drill 0.35)
  Top 0.254: U6.P$1 42.54,12.07 C16.P$1 | U6.P$3 40.64,12.07 C16.P$1 | C16.P$1 R15.P$1 v39.37,12.38 | U2.3 46.82,7.87 C13.P$1 46.99,7.55 v46.99,6.83
  Top 0.406: v22.23,13.97 8.26,13.97 J8.P$1
  PWR 0.406: v22.23,13.97 27.94,8.26 27.94,6.99 J4.P$2 J3.P$2 44.61,4.45 v46.99,6.83 44.93,6.83 v39.37,12.38
  Bottom 0.406: U1.1 4.13,18.1 J8.P$1
+24V  (via drill 0.35)
  Top 0.254: C14.P$1 v49.53,13.34 48.58,13.34 48.12,12.87 U2.10
  pour PWR (no thermals): 41.75,43.34 41.75,60.33 60.33,60.33 60.33,35.56 50.16,35.56 46.67,39.05 46.67,43.34
  pour PWR (no thermals): 41.75,36.51 41.75,11.75 60.33,11.75 60.33,35.56 50.16,35.56 52.07,33.66 52.07,27.94 46.35,27.94 46.35,31.91
+24V_SWITCHED
  pour Top (no thermals): 47.31,28.89 47.31,32.07 41.75,37.62 41.75,42.39 45.72,42.39 45.72,39.05 51.12,33.66 51.12,28.89
  pour PWR (no thermals): 41.75,42.39 41.75,37.62 47.31,32.07 47.31,28.89 51.12,28.89 51.12,33.66 45.72,39.05 45.72,42.39
A6  (via drill 0.35)
  Top 0.254: U4.6 30.14,48.6 32.38,46.35 32.38,37.15 v35.88,33.66 | v35.88,25.08 35.88,9.53
  Top 0.406: 35.88,9.53 J3.P$1
  Bottom 0.254: v35.88,33.66 v35.88,25.08
C6  (via drill 0.35)
  Top 0.254: U4.7 30.28,49.1 33.04,46.33 v33.04,38.42 | v27.62,33.02 27.62,8.89
  Top 0.406: 27.62,8.89 J7.P$1
  Bottom 0.254: v33.04,38.42 27.64,33.02 v27.62,33.02
CAN_CS
  Top 0.254: U4.53 18.89,42.07 20.64,40.32 20.64,40.01 20.95,39.69 24.45,39.69 44.45,19.68 44.45,13.97 45.52,12.9 U2.14
CAN_N
  Top 0.254: CH1.P$3 47.06,17.85 R8.P$2 47.06,22.93 47.31,23.18
  Top 0.406: J1.2 49.21,25.08 47.31,23.18
CAN_P
  Top 0.254: CH1.P$2 45.96,17.85 R8.P$1 45.96,22.85 45.72,23.09
  Top 0.406: 45.72,23.09 J1.4
CAN_RST  (via drill 0.35)
  Top 0.254: U4.62 23.39,43.13 25.4,41.12 25.4,40.64 v44.77,21.27 | v49.53,18.26 53.66,14.13 53.66,10 51.59,7.94 48.58,7.94 48.12,8.4 U2.5
  Bottom 0.254: v44.77,21.27 46.51,21.27 v49.53,18.26
CAN_RX  (via drill 0.35)
  Top 0.254: U4.61 22.89,42.99 24.61,41.27 24.61,40.48 v44.77,20.32 | v51.44,17.46 54.29,14.61 54.29,9.84 51.75,7.3 48.42,7.3 47.47,8.26 U2.4
  Bottom 0.254: v44.77,20.32 47.62,17.46 v51.44,17.46
CAN_TX  (via drill 0.35)
  Top 0.254: U4.48 15.81,46.1 v15.88,46.04 | v21.27,38.73 23.5,38.73 43.5,18.73 43.5,8.65 R1.P$2 45.52,8.44 U2.1
  Bottom 0.254: v15.88,46.04 15.88,44.13 v21.27,38.73
GND  (via drill 0.35)
  Top 0.152: U5.3 12.61,35.15 v12.7,35.24
  Top 0.254: C28.P$2 v11.83,47.62 C19.P$2 | Q2.2 v9.53,48.1 | C22.P$2 v14.45,41.43 | C26.P$2 22.39,57.24 U4.21 22.39,54.77 22.23,54.61 20,54.61 19.89,54.73 U4.26 | C26.P$2 21.43,58.65 C18.P$2 v19.21,58.65 C27.P$2 | U4.17 24.39,56.58 23.5,57.47 C26.P$2 | C20.P$2 v22.07,40.41 C24.P$2 | C30.P$2 v26.83,58.26 | U4.45 v15.92,47.6 | U4.58 v21.39,45.13 | C29.P$2 v12.22,56.04 | v12.22,56.04 | C25.P$2 v30,53.82 | C21.P$2 v26.83,41.43 | v26.83,41.43 | U6.P$2 41.59,6.67 C17.P$2 v40.01,5.71 | D3.CATHODE 41.23,15.28 C16.P$2 v42.54,14.92 v42.55,14.92 | U4.5 28.65,48.1 C15.P$2 v29.84,47.47 | C31.P$2 v12.86,40.01 13.41,40.01 C23.P$2 | C13.P$2 46.17,7.82 U2.2 46.17,10.54 U2.15_3
  Top 0.406: U9.4 20,34.29 19.37,34.92 | U9.3 18.73,34.29 19.37,34.92 | 19.37,34.92 18.65,35.65 C51.P$2 v14.61,35.08
  pour GND (no thermals): 0,60.33 0,0 60.33,0 60.33,60.33
  pour Bottom (no thermals): 0,60.33 0,0 60.33,0 60.33,60.33
  pour Top (no thermals): 45.09,10 51.75,10 51.75,13.97 50.8,13.97 50.8,11.91 50.48,11.59 45.09,11.59
MCU_MEM-WC
  Top 0.254: R33.P$2 20.64,34.92 17.46,38.1 U9.7 17.39,38.97 U4.50
MCU_SCI_RX  (via drill 0.35)
  Top 0.254: U4.34 12.31,53.1 10.95,54.45 9.21,54.45 2.22,47.47 v2.22,32.07
  Bottom 0.406: J8.P$2 4.13,20.64 U1.18 4.13,30.16 v2.22,32.07
MCU_SCI_TX  (via drill 0.35)
  Top 0.254: U4.35 12.17,52.6 10.79,53.98 9.53,53.98 2.86,47.31 2.86,33.97 v4.13,32.7
  Bottom 0.406: J8.P$3 6.67,20.64 6.67,28.26 U1.17 6.67,30.16 v4.13,32.7
MCU_SCL
  Top 0.254: R232.P$2 20.64,36.2 18.73,38.1 U9.6 18.73,40.32 17.89,41.17 U4.51
MCU_SCLK  (via drill 0.35)
  Top 0.254: U4.2 27.48,46.6 v27.53,46.64 | v29.21,45.09 30.8,43.5 30.8,37.15 40.64,27.3 49.85,27.3 53.02,24.13 v53.02,17.14 | U2.8 50.14,12.2 v50.16,12.22
  Bottom 0.254: v27.53,46.64 27.66,46.64 v29.21,45.09 | v50.16,12.22 53.02,15.08 v53.02,17.14
MCU_SDA
  Top 0.254: R233.P$2 20.64,37.47 20,38.1 U9.5 20,40.32 18.39,41.94 U4.52
MCU_SDI  (via drill 0.35)
  Top 0.254: U4.64 24.39,43.08 26.04,41.43 26.04,40.96 v41.27,25.72 | v48.58,20.32 48.58,18.1 53.02,13.65 53.02,10.16 51.44,8.57 48.9,8.57 48.77,8.7 U2.6
  Bottom 0.254: v48.58,20.32 46.67,22.23 43.81,22.23 41.27,24.77 v41.27,25.72
MCU_SDO  (via drill 0.35)  (1 unrouted)
  Top 0.254: v43.5,19.68 v24.29,38.89 | U4.57 20.89,43.11 20.34,42.57 v20,42.57 | U2.11 47.47,13.33 v47.47,13.34
  Bottom 0.254: v47.47,13.34 47.47,15.72 v43.5,19.68 | v20,42.57 20,40.96 21.59,39.37 23.81,39.37 v24.29,38.89
N$1
  Top 0.254: R15.P$2 39.73,15.28 D3.ANODE
N$4
  Top 0.254: U2.12 46.82,13.65 CH1.P$4
N$5  (via drill 0.35)
  Top 0.406: v9.68,36.2 R12.P$2
  Bottom 0.406: CON3.P$5 v9.68,36.2
N$6
  Top 0.254: R9.P$2 8.32,48.57 Q2.3
N$10  (via drill 0.35)
  Top 0.254: v3.81,41.27 3.81,34.61 6.21,32.2 8.95,32.2 R11.P$2
  Bottom 0.406: CON3.P$13 v3.81,41.27
N$11  (via drill 0.35)
  Top 0.254: R13.P$2 v12.7,41.27
  Bottom 0.254: v12.7,41.27 CON3.P$14
N$12  (via drill 0.35)
  Top 0.254: D1.C v3.81,42.55
  Bottom 0.254: v3.81,42.55 CON3.P$15
N$17
  Top 0.254: U2.13 46.17,13.7 CH1.P$1
N$25
  Top 0.254: U5.2 11.59,34.13 | 11.59,34.13 R14.P$2 | D1.A 5.78,33.91 6.99,32.7 7.94,32.7 9.37,34.13 11.59,34.13
N$32
  Top 0.254: U4.11 26.44,51.12
TCK  (via drill 0.35)
  Top 0.254: v10.48,53.02 10.79,53.02 11.72,52.1 U4.36
  Bottom 0.406: v10.48,53.02 7.94,50.48 7.94,40.32 7.62,40.01 CON3.P$11 CON3.P$9
TDI  (via drill 0.35)
  Top 0.254: v8.26,34.92 8.26,43.18 7.23,44.2 7.23,50.01 7.82,50.6 U4.39
  Bottom 0.406: CON3.P$3 v8.26,34.92
TDO  (via drill 0.35)
  Top 0.254: U4.37 10.97,51.6 v10.65,51.92
  Bottom 0.406: CON3.P$7 7.62,37.47 8.58,38.42 8.58,49.85 v10.65,51.92
TMS  (via drill 0.35)
  Top 0.254: v7.46,33.66 7.46,43.02 6.67,43.81 6.67,50.16 7.62,51.12 14.84,51.12 U4.38
  Bottom 0.406: CON3.P$1 v7.46,33.66
X1
  Top 0.254: U4.42 10.75,49.1 R10.P$2 10.72,48.57 Q2.1
X2
  Top 0.254: U4.41 10.8,49.6 R10.P$1 R9.P$1
XBAR4  (via drill 0.35)
  Top 0.254: U4.32 16.89,54.55 22.54,48.9 v24.45,48.9 | 26.51,10.64 v26.51,34.61
  Top 0.406: J6.P$1 26.51,10.64
  Bottom 0.254: v24.45,48.9 24.45,42.55 26.51,40.48 v26.51,34.61
XBAR6  (via drill 0.35)
  Top 0.254: 33.97,10.48 v33.97,26.67 | v26.35,44.45 26.35,46.03 U4.1
  Top 0.406: J4.P$1 33.97,10.48
  Bottom 0.254: v33.97,26.67 33.97,38.89 31.59,41.27 29.53,41.27 v26.35,44.45
XBAR7  (via drill 0.35)
  Top 0.254: U4.33 16.25,53.6 21.93,47.92 v23.18,47.92 | 25.4,12.38 v25.4,35.56
  Top 0.406: 25.4,12.38 J5.P$1
  Bottom 0.254: v23.18,47.92 23.18,42.86 25.4,40.64 v25.4,35.56

### Text on the board
tNames: Power IN / GND +24V | Switched Power | CAN H | CAN L | 5V / / RX / / TX / / GND | Sig / / 3.3V / / GND | Sig / / 5V / / GND
bNames: Made for Idaho Outreach / By Shaun Martin of CoolBots